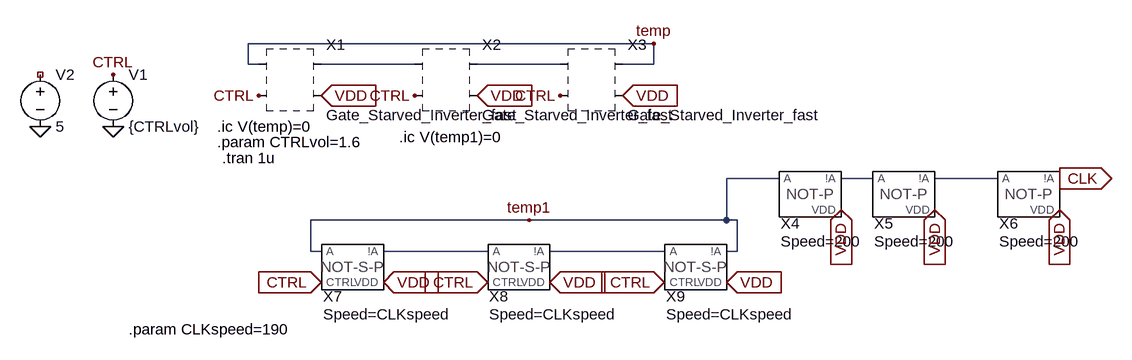
[diagram p0: schematic CLK.asc]
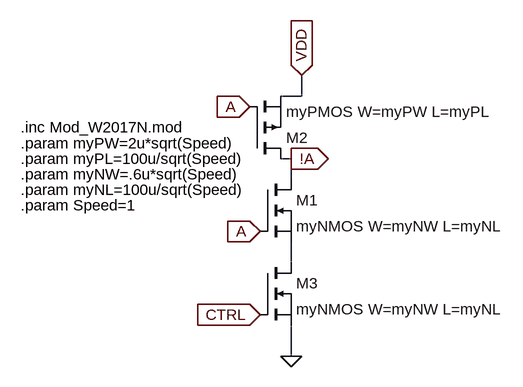
[diagram p1: sub-circuit gate_not_starved_param.asc]
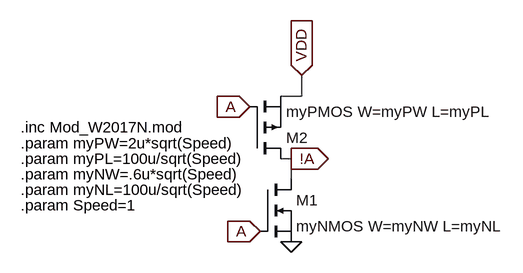
[diagram p2: sub-circuit gate_not_param.asc]
CLK.asc, the LTspice schematic file:
Version 4
SHEET 1 2856 680
WIRE 352 80 -272 80
WIRE -272 112 -272 80
WIRE -256 112 -272 112
WIRE -16 112 -160 112
WIRE 208 112 80 112
WIRE 352 112 352 80
WIRE 352 112 304 112
WIRE 544 288 464 288
WIRE 688 288 640 288
WIRE 880 288 784 288
WIRE 160 352 -176 352
WIRE 464 352 464 288
WIRE 464 352 160 352
WIRE 480 352 464 352
WIRE -176 400 -176 352
WIRE -160 400 -176 400
WIRE 96 400 -64 400
WIRE 368 400 192 400
WIRE 480 400 480 352
WIRE 480 400 464 400
FLAG -160 160 VDD
IOPIN -160 160 In
FLAG -256 160 CTRL
FLAG -480 208 0
FLAG -480 128 CTRL
FLAG 80 160 VDD
IOPIN 80 160 In
FLAG -16 160 CTRL
FLAG 304 160 VDD
IOPIN 304 160 In
FLAG 208 160 CTRL
FLAG 976 288 CLK
IOPIN 976 288 Out
FLAG -592 208 0
FLAG 352 80 temp
FLAG -64 448 VDD
IOPIN -64 448 In
FLAG 192 448 VDD
IOPIN 192 448 In
FLAG 464 448 VDD
IOPIN 464 448 In
FLAG 160 352 temp1
FLAG -160 448 CTRL
IOPIN -160 448 In
FLAG 96 448 CTRL
IOPIN 96 448 In
FLAG 368 448 CTRL
IOPIN 368 448 In
FLAG 640 336 VDD
IOPIN 640 336 In
FLAG 784 336 VDD
IOPIN 784 336 In
FLAG 976 336 VDD
IOPIN 976 336 In
SYMBOL voltage -480 112 R0
WINDOW 123 0 0 Left 2
WINDOW 39 0 0 Left 2
SYMATTR InstName V1
SYMATTR Value {CTRLvol}
SYMBOL Gate_Starved_Inverter_fast -208 144 R0
SYMATTR InstName X1
SYMBOL Gate_Starved_Inverter_fast 32 144 R0
SYMATTR InstName X2
SYMBOL Gate_Starved_Inverter_fast 256 144 R0
SYMATTR InstName X3
SYMBOL voltage -592 112 R0
SYMATTR InstName V2
SYMATTR Value 5
SYMBOL Gate_NOT_Starved_PARAM -112 432 R0
WINDOW 39 -45 65 Left 2
SYMATTR InstName X7
SYMATTR SpiceLine Speed=CLKspeed
SYMBOL Gate_NOT_Starved_PARAM 144 432 R0
WINDOW 39 -45 65 Left 2
SYMATTR InstName X8
SYMATTR SpiceLine Speed=CLKspeed
SYMBOL Gate_NOT_Starved_PARAM 416 432 R0
WINDOW 39 -45 65 Left 2
SYMATTR InstName X9
SYMATTR SpiceLine Speed=CLKspeed
SYMBOL Gate_NOT_PARAM 592 320 R0
WINDOW 39 -45 65 Left 2
SYMATTR InstName X4
SYMATTR SpiceLine Speed=200
SYMBOL Gate_NOT_PARAM 736 320 R0
WINDOW 39 -45 65 Left 2
SYMATTR InstName X5
SYMATTR SpiceLine Speed=200
SYMBOL Gate_NOT_PARAM 928 320 R0
WINDOW 39 -45 65 Left 2
SYMATTR InstName X6
SYMATTR SpiceLine Speed=200
TEXT -320 232 Left 2 !.param CTRLvol=1.6
TEXT -320 208 Left 2 !.ic V(temp)=0
TEXT -312 256 Left 2 !.tran 1u
TEXT -40 224 Left 2 !.ic V(temp1)=0
TEXT -456 520 Left 2 !.param CLKspeed=190

gate_not_starved_param.asc, the sub-circuit schematic file:
Version 4
SHEET 1 880 680
WIRE 64 -112 64 -144
WIRE 64 -112 32 -112
WIRE 48 -16 32 -16
WIRE 48 16 48 -16
WIRE 48 144 48 112
WIRE 48 288 48 240
FLAG 48 -16 !A
IOPIN 48 -16 Out
FLAG 64 -144 VDD
IOPIN 64 -144 In
FLAG 48 288 0
FLAG 0 96 A
IOPIN 0 96 In
FLAG -16 -96 A
IOPIN -16 -96 In
FLAG 0 224 CTRL
IOPIN 0 224 In
SYMBOL nmos 0 16 R0
SYMATTR InstName M1
SYMATTR Value myNMOS W=myNW L=myNL
SYMBOL pmos -16 -16 M180
SYMATTR InstName M2
SYMATTR Value myPMOS W=myPW L=myPL
SYMBOL nmos 0 144 R0
SYMATTR InstName M3
SYMATTR Value myNMOS W=myNW L=myNL
TEXT -368 -64 Left 2 !.inc Mod_W2017N.mod
TEXT -368 -40 Left 2 !.param myPW=2u*sqrt(Speed)
TEXT -368 -16 Left 2 !.param myPL=100u/sqrt(Speed)
TEXT -368 8 Left 2 !.param myNW=.6u*sqrt(Speed)
TEXT -368 32 Left 2 !.param myNL=100u/sqrt(Speed)
TEXT -368 56 Left 2 !.param Speed=1

gate_not_param.asc, the sub-circuit schematic file:
Version 4
SHEET 1 880 680
WIRE 64 -112 64 -144
WIRE 64 -112 32 -112
WIRE 48 -16 32 -16
WIRE 48 16 48 -16
FLAG 48 -16 !A
IOPIN 48 -16 Out
FLAG 64 -144 VDD
IOPIN 64 -144 In
FLAG 48 112 0
FLAG 0 96 A
IOPIN 0 96 In
FLAG -16 -96 A
IOPIN -16 -96 In
SYMBOL nmos 0 16 R0
SYMATTR InstName M1
SYMATTR Value myNMOS W=myNW L=myNL
SYMBOL pmos -16 -16 M180
SYMATTR InstName M2
SYMATTR Value myPMOS W=myPW L=myPL
TEXT -368 -64 Left 2 !.inc Mod_W2017N.mod
TEXT -368 -40 Left 2 !.param myPW=2u*sqrt(Speed)
TEXT -368 -16 Left 2 !.param myPL=100u/sqrt(Speed)
TEXT -368 8 Left 2 !.param myNW=.6u*sqrt(Speed)
TEXT -368 32 Left 2 !.param myNL=100u/sqrt(Speed)
TEXT -368 56 Left 2 !.param Speed=1

The netlist it stands for:
* CLK.asc
V1 CTRL 0 {CTRLvol}
* X1: Gate_Starved_Inverter_fast (symbol Gate_Starved_Inverter_fast not available, pin order unknown); nets seen at it: CTRL, N001, temp, VDD
* X2: Gate_Starved_Inverter_fast (symbol Gate_Starved_Inverter_fast not available, pin order unknown); nets seen at it: CTRL, N001, N002, VDD
* X3: Gate_Starved_Inverter_fast (symbol Gate_Starved_Inverter_fast not available, pin order unknown); nets seen at it: CTRL, N002, temp, VDD
V2 NC_01 0 5
XX7 temp1 VDD N005 CTRL gate_not_starved_param params: Speed=CLKspeed
XX8 N005 VDD N006 CTRL gate_not_starved_param params: Speed=CLKspeed
XX9 N006 VDD temp1 CTRL gate_not_starved_param params: Speed=CLKspeed
XX4 temp1 VDD N003 gate_not_param params: Speed=200
XX5 N003 VDD N004 gate_not_param params: Speed=200
XX6 N004 VDD CLK gate_not_param params: Speed=200

* block symbol definitions
.subckt gate_not_starved_param A VDD !A CTRL
M1 !A A N001 N001 myNMOS W=myNW L=myNL
M2 !A A VDD VDD myPMOS W=myPW L=myPL
M3 N001 CTRL 0 0 myNMOS W=myNW L=myNL
.inc Mod_W2017N.mod
.param myPW=2u*sqrt(Speed)
.param myPL=100u/sqrt(Speed)
.param myNW=.6u*sqrt(Speed)
.param myNL=100u/sqrt(Speed)
.param Speed=1
.ends gate_not_starved_param

.subckt gate_not_param A VDD !A
M1 !A A 0 0 myNMOS W=myNW L=myNL
M2 !A A VDD VDD myPMOS W=myPW L=myPL
.inc Mod_W2017N.mod
.param myPW=2u*sqrt(Speed)
.param myPL=100u/sqrt(Speed)
.param myNW=.6u*sqrt(Speed)
.param myNL=100u/sqrt(Speed)
.param Speed=1
.ends gate_not_param

.model NMOS NMOS
.model PMOS PMOS
.lib standard.mos
.param CTRLvol=1.6
.ic V(temp)=0
.tran 1u
.ic V(temp1)=0
.param CLKspeed=190
.backanno
.end